# EAGLE schematic cansat (EAGLE 9.6.2)
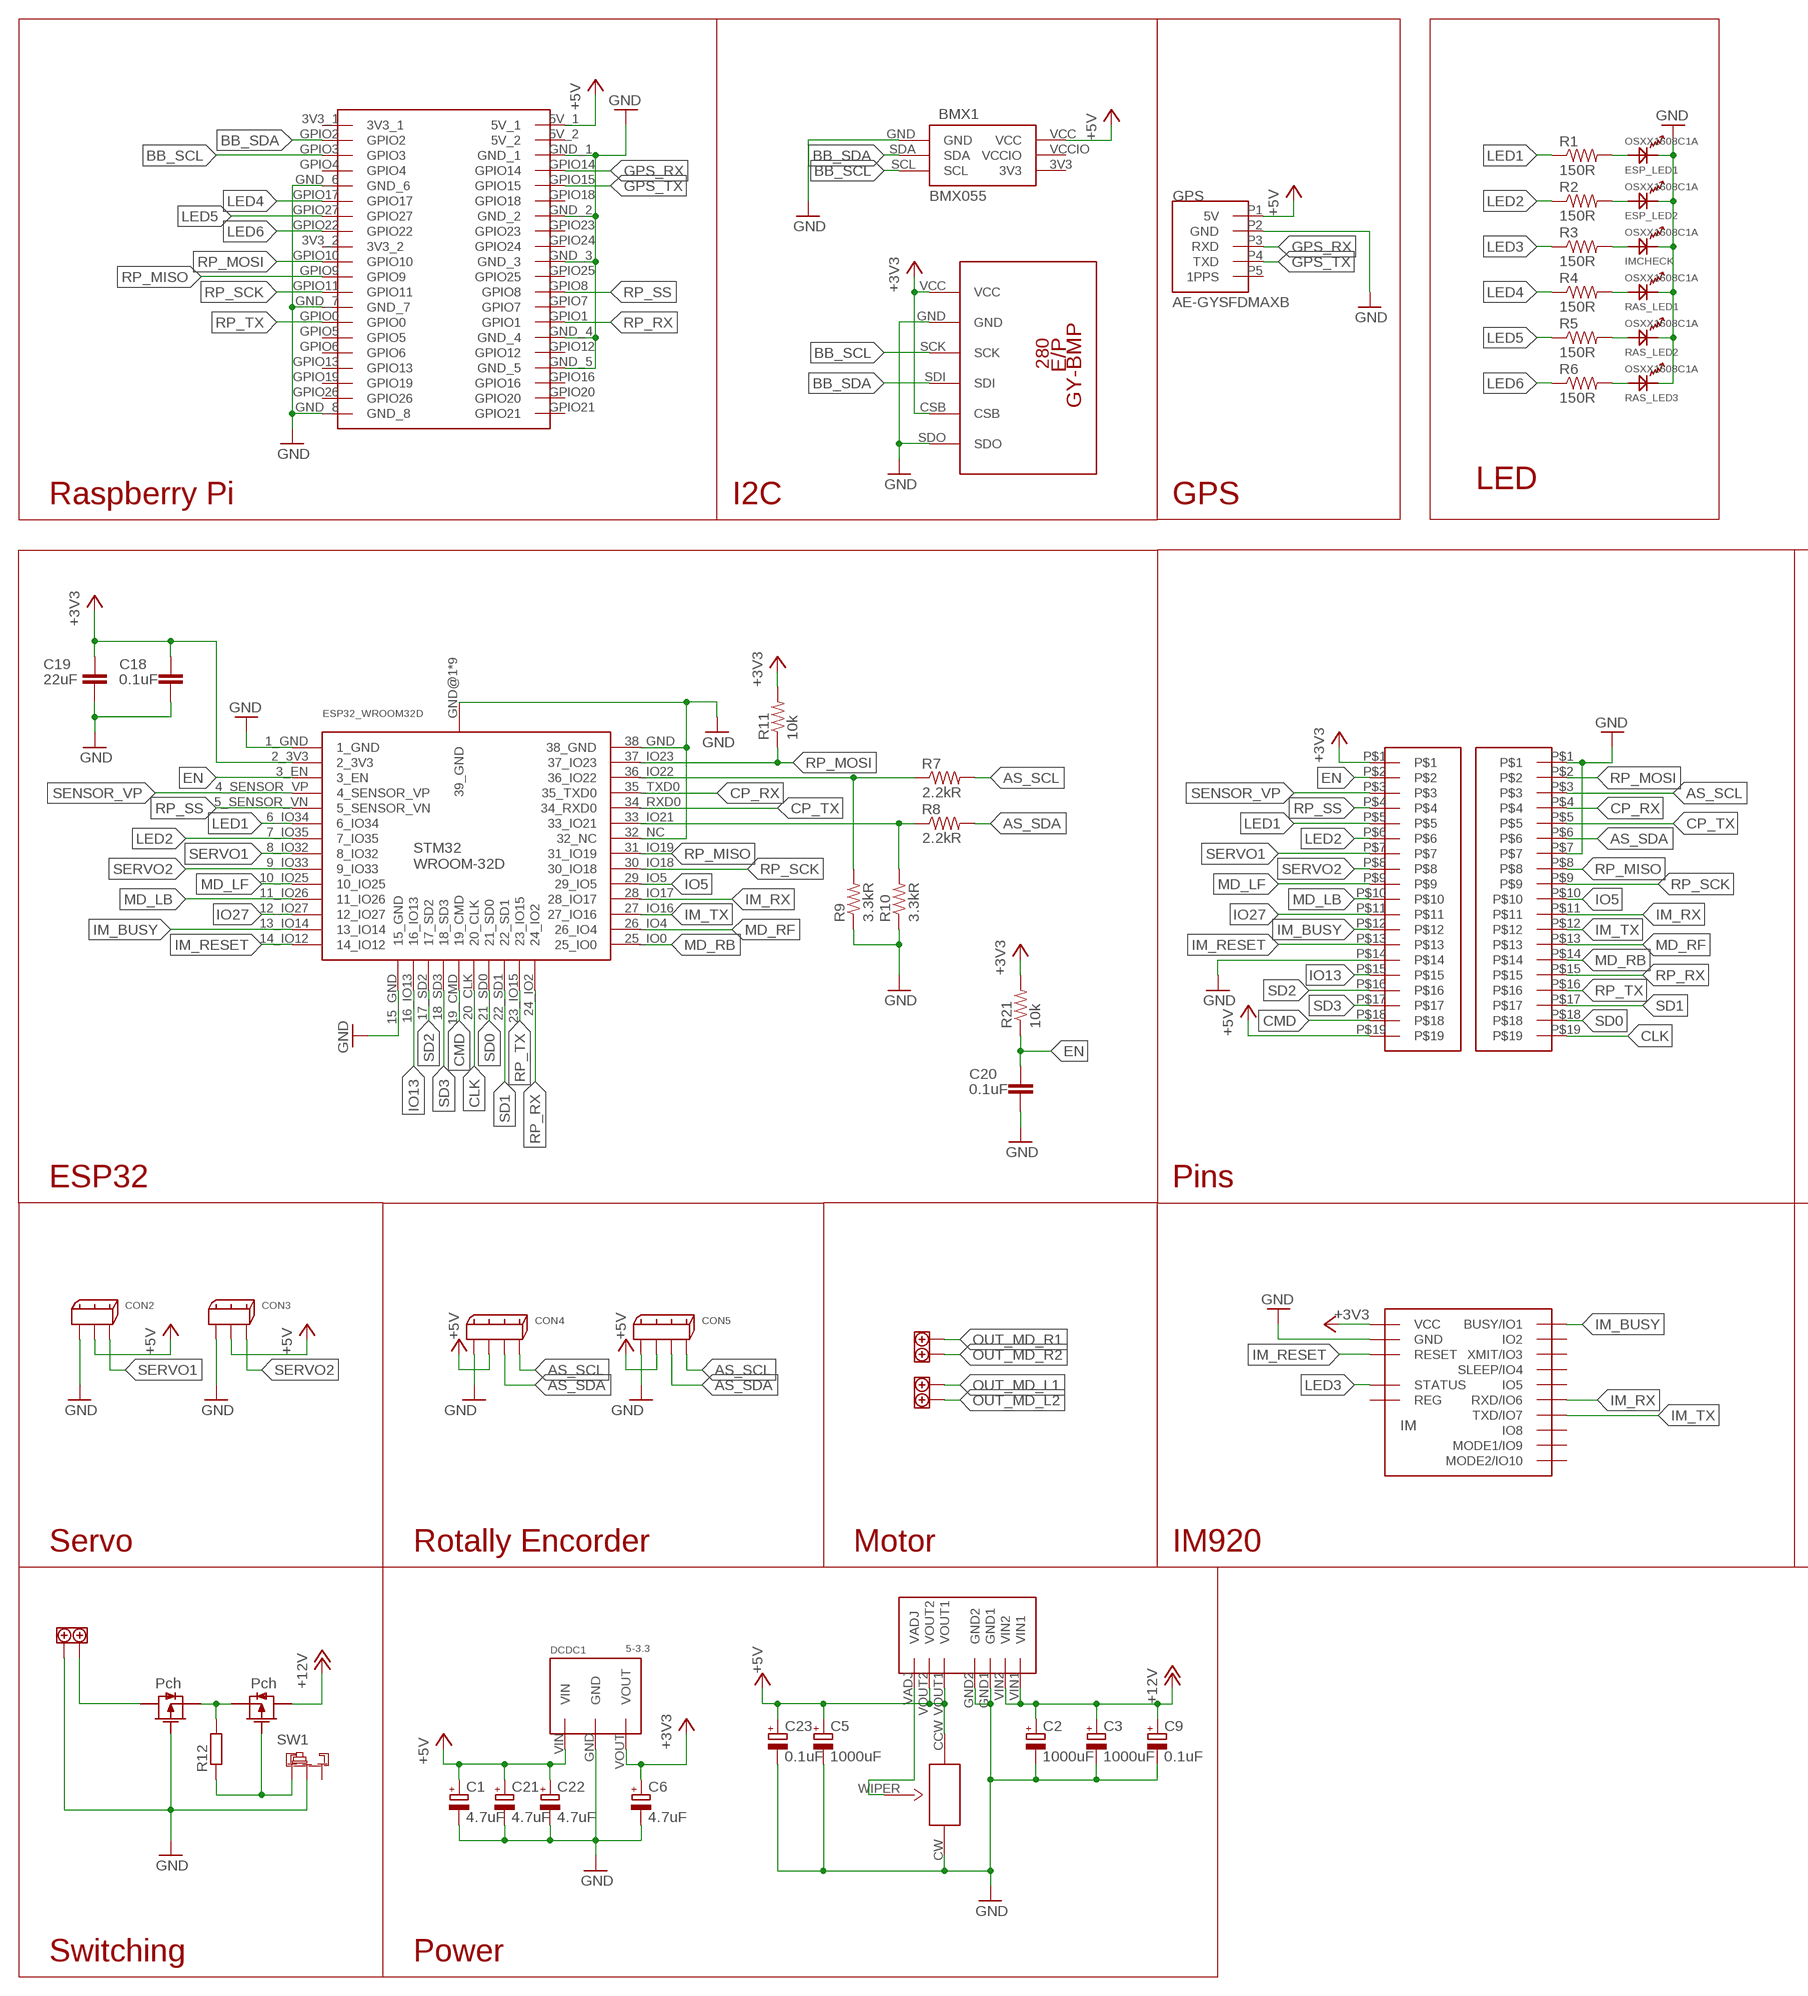
[diagram p0: schematic, sheet 1, part 1 of 2]
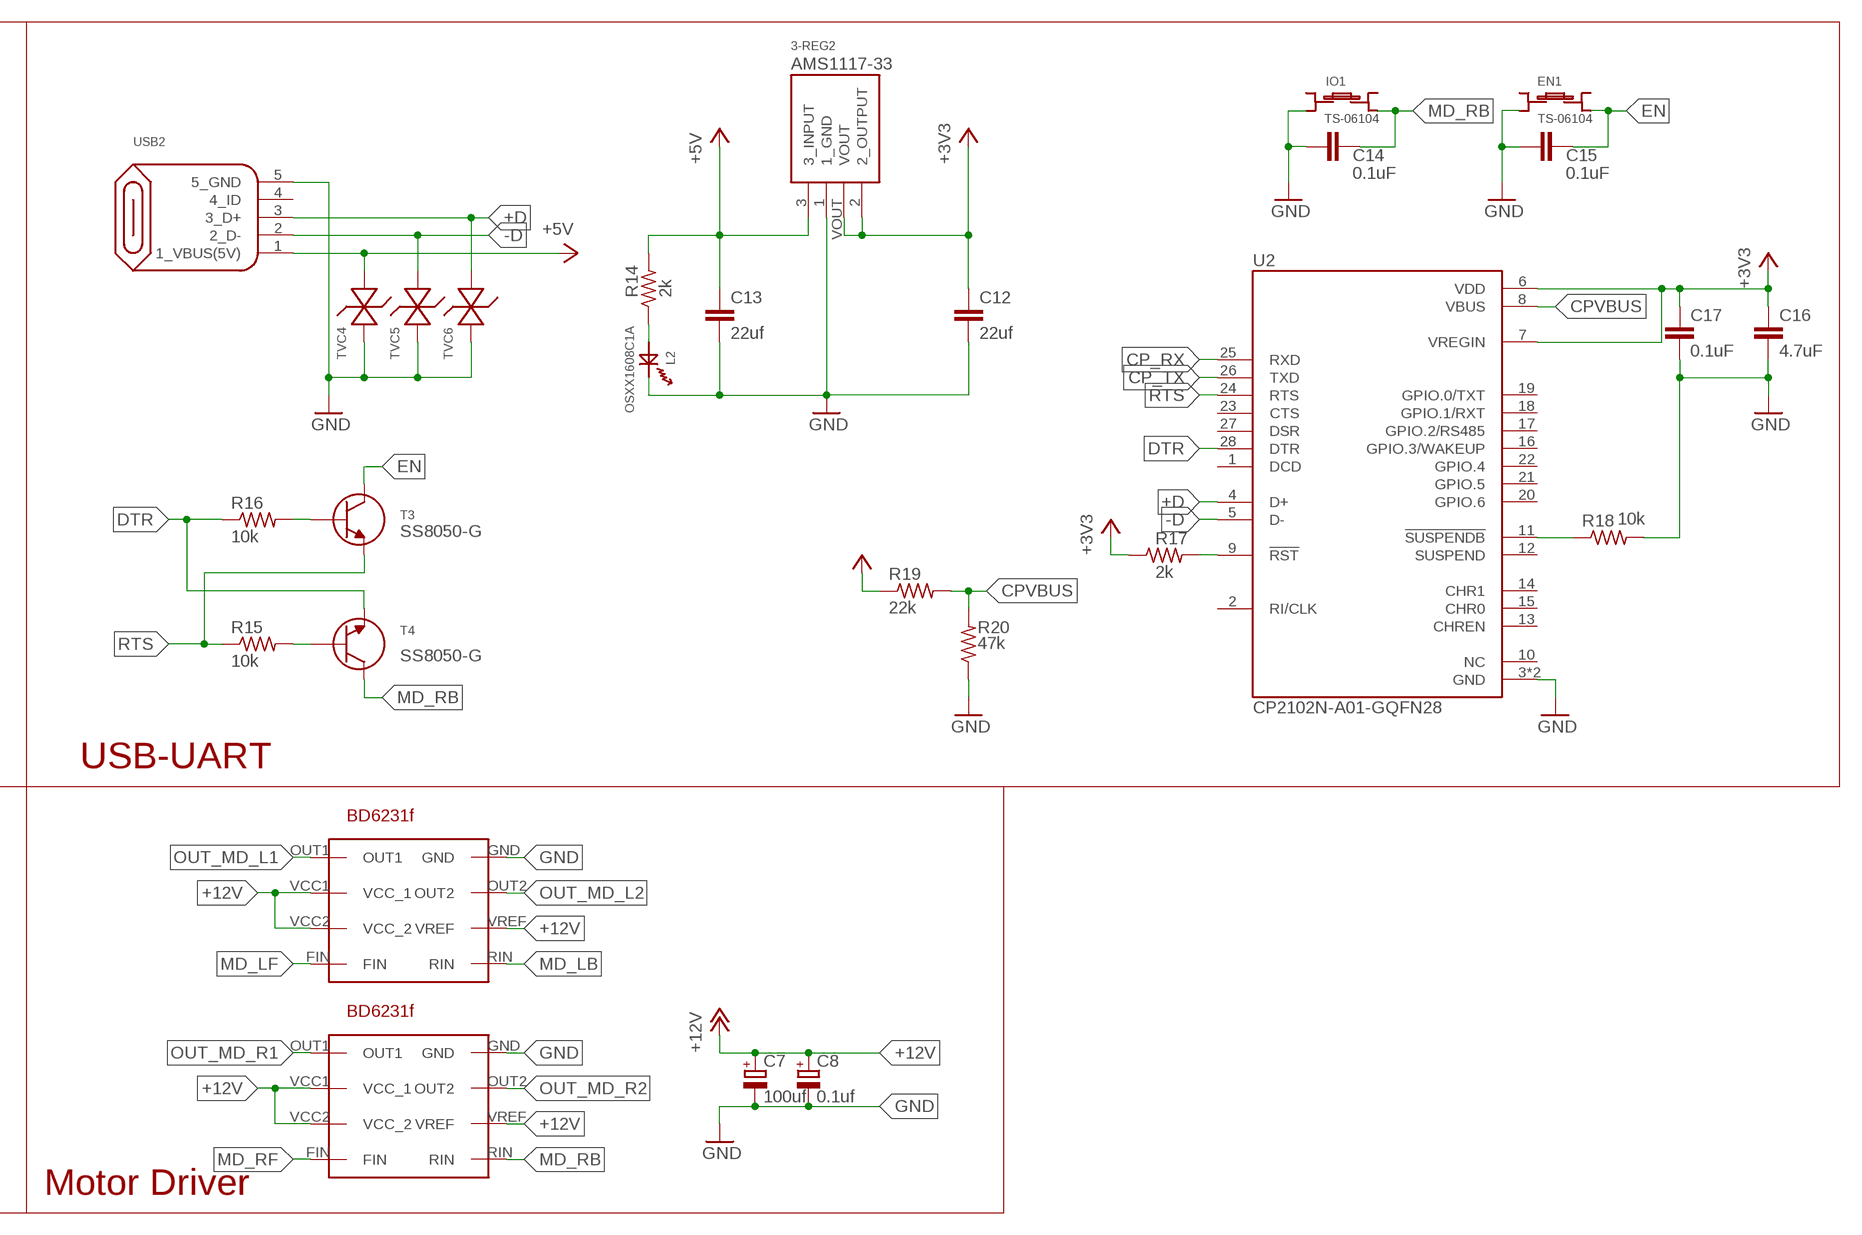
[diagram p1: schematic, sheet 1, part 2 of 2]

## Parts
3-REG2  AZ1117CH-3.3TRG1  [AZ1117CH-3.3TRG1]
100KR1  100kR  3362P  [3362P]
BMX1  BMX055  [BMX055]
C1  4.7uF  CPOL-EUE2.5-7  [E2,5-7]
C2  1000uF  CPOL-EUE5-10.5  [E5-10,5]
C3  1000uF  CPOL-EUE5-10.5  [E5-10,5]
C5  1000uF  CPOL-EUE5-10.5  [E5-10,5]
C6  4.7uF  CPOL-EUE2.5-7  [E2,5-7]
C7  100uf  CPOL-EUE2.5-7  [E2,5-7]
C8  0.1uf  CPOL-EUE2.5-7  [E2,5-7]
C9  0.1uF  CPOL-EUE2.5-7  [E2,5-7]
C12  22uf  C-EUC0603  [C0603]
C13  22uf  C-EUC0603  [C0603]
C14  0.1uF  C-EUC0603  [C0603]
C15  0.1uF  C-EUC0603  [C0603]
C16  4.7uF  C-EUC0402  [C0402]
C17  0.1uF  C-EUC0603  [C0603]
C18  0.1uF  C-EUC0603  [C0603]
C19  22uF  C-EUC0603  [C0603]
C20  0.1uF  C-EUC0603  [C0603]
C21  4.7uF  CPOL-EUE2.5-7  [E2,5-7]
C22  4.7uF  CPOL-EUE2.5-7  [E2,5-7]
C23  0.1uF  CPOL-EUE5-10.5  [E5-10,5]
CON2  2.5_MINI-SPOX_3PIN  [2.5_MINI-SPOX_3PIN]
CON3  2.5_MINI-SPOX_3PIN  [2.5_MINI-SPOX_3PIN]
CON4  2.5_MINI-SPOX_4PIN  [2.5_MINI-SPOX_4PIN]
CON5  2.5_MINI-SPOX_4PIN  [2.5_MINI-SPOX_4PIN]
DCDC1  5-3.3  3.3V0.5A_M78AR05-0.5  [3.3V0.5A_M78AR05-0.5]
EN1  TS-06104  [TS-06104]
ESP32_WROOM32D  ESP32-WROOM-32D  [ESP32-WROOM-32D]
ESP_LED1  OSXX1608C1A  [OSXX1608C1A]
ESP_LED2  OSXX1608C1A  [OSXX1608C1A]
GPS  AE-GYSFDMAXB  [AE-GYSFDMAXB]
IM  IM920C  [IM920C]
IMCHECK  OSXX1608C1A  [OSXX1608C1A]
IO1  TS-06104  [TS-06104]
L2  OSXX1608C1A  [OSXX1608C1A]
MD_L  BD6231F  [BD6231F]
MD_R  BD6231F  [BD6231F]
PIN_L  19_2.54  [19_2.54]
PIN_R  19_2.54  [19_2.54]
R1  150R  R-US_R0603  [R0603]
R2  150R  R-US_R0603  [R0603]
R3  150R  R-US_R0603  [R0603]
R4  150R  R-US_R0603  [R0603]
R5  150R  R-US_R0603  [R0603]
R6  150R  R-US_R0603  [R0603]
R7  2.2kR  R-US_R0603  [R0603]
R8  2.2kR  R-US_R0603  [R0603]
R9  3.3kR  R-US_R0603  [R0603]
R10  3.3kR  R-US_R0603  [R0603]
R11  10k  R-US_R0201  [R0201]
R12  R-EU_0207/10  [0207/10]
R14  2k  R-US_R0201  [R0201]
R15  10k  R-US_R0201  [R0201]
R16  10k  R-US_R0201  [R0201]
R17  2k  R-US_R0201  [R0201]
R18  10k  R-US_R0201  [R0201]
R19  22k  R-US_R0201  [R0201]
R20  47k  R-US_R0201  [R0201]
R21  10k  R-US_R0201  [R0201]
RAS_LED1  OSXX1608C1A  [OSXX1608C1A]
RAS_LED2  OSXX1608C1A  [OSXX1608C1A]
RAS_LED3  OSXX1608C1A  [OSXX1608C1A]
RASPBERRYPI_4B  RASPBERRYPI4B  [RASPBERRYPI4B]
SW1  SRIDE_SWITCH  [SRIDE_SWITCH]
T3  NPN_SS8050-G  [NPN_SS8050-G]
T4  NPN_SS8050-G  [NPN_SS8050-G]
TM1  TERMINAL_SLOPED_2PIN  [TERMINAL_SLOPED_2PIN]
TM2  TERMINAL_SLOPED_2PIN  [TERMINAL_SLOPED_2PIN]
TM3  TERMINAL_SLOPED_2PIN  [TERMINAL_SLOPED_2PIN]
TVC4  ESD5484FCT5G  [ESD5484FCT5G]
TVC5  ESD5484FCT5G  [ESD5484FCT5G]
TVC6  ESD5484FCT5G  [ESD5484FCT5G]
U2  CP2102N-A01-GQFN28  [QFN50P500X500X80-29N]
U$7  2SJ681-PCH  [2SJ681]
U$8  5V3A_KIC-053  [5V3A_KIC-053]
U$9  GY-BPM280  [GY-BMP280-FOOTPRINT]
U$10  2SJ681-PCH  [2SJ681]
USB2  MICRO-B_ZX62R-B-5P  [MICRO-B_ZX62R-B-5P]

## Nets
+3V3: 3-REG2.2(2_OUTPUT) 3-REG2.VOUT C6.+ C12.1 C16.1 C17.1 C18.1 C19.1 DCDC1.VOUT ESP32_WROOM32D.2_3V3 IM.$P17(VCC) PIN_L.P$1 R11.2 R17.1 R21.2 U2.6(VDD) U2.7(VREGIN) U$9.CSB U$9.VCC
+5V: 3-REG2.3(3_INPUT) 100KR1.CCW BMX1.VCC C1.+ C5.+ C13.1 C21.+ C22.+ C23.+ CON2.2 CON3.2 CON4.P$2 CON5.P$2 DCDC1.VIN GPS.P1(5V) PIN_L.P$19 R14.2 R19.1 RASPBERRYPI_4B.5V_1 TVC4.2_AN U$8.VOUT1 U$8.VOUT2 USB2.1(1_VBUS(5V))
+12V: C2.+ C3.+ C7.+ C8.+ C9.+ MD_L.VCC1(VCC_1) MD_L.VCC2(VCC_2) MD_L.VREF MD_R.VCC1(VCC_1) MD_R.VCC2(VCC_2) MD_R.VREF U$8.VIN1 U$8.VIN2 U$10.DRAIN
+D: TVC6.2_AN U2.4(D+) USB2.3(3_D+)
-D: TVC5.2_AN U2.5(D-) USB2.2(2_D-)
A7_1: R12.2 U$7.SOURCE U$10.SOURCE
AS_SCL: CON4.P$4 CON5.P$4 PIN_R.P$3 R7.2
AS_SDA: CON4.P$3 CON5.P$3 PIN_R.P$6 R8.2
BB_SCL: BMX1.SCL RASPBERRYPI_4B.GPIO3 U$9.SCK
BB_SDA: BMX1.SDA RASPBERRYPI_4B.GPIO2 U$9.SDI
CLK: ESP32_WROOM32D.20_CLK PIN_R.P$19
CMD: ESP32_WROOM32D.19_CMD PIN_L.P$18
CP_RX: ESP32_WROOM32D.35_TXD0 PIN_R.P$4 U2.25(RXD)
CP_TX: ESP32_WROOM32D.34_RXD0 PIN_R.P$5 U2.26(TXD)
CPVBUS: R19.2 R20.2 U2.8(VBUS)
DTR: R16.1 T4.2 U2.28(DTR)
EN: C15.1 C20.1 EN1.D ESP32_WROOM32D.3_EN PIN_L.P$2 R21.1 T3.3
GND [GND_+12V]: 3-REG2.1(1_GND) 100KR1.CW BMX1.GND C1.- C2.- C3.- C5.- C6.- C7.- C8.- C9.- C12.2 C13.2 C14.2 C15.2 C16.2 C17.2 C18.2 C19.2 C20.2 C21.- C22.- C23.- CON2.1 CON3.1 CON4.P$1 CON5.P$1 DCDC1.GND EN1.B ESP32_WROOM32D.1_GND ESP32_WROOM32D.15_GND ESP32_WROOM32D.32_NC ESP32_WROOM32D.38_GND ESP32_WROOM32D.GND@1(39_GND) ESP32_WROOM32D.GND@2(39_GND) ESP32_WROOM32D.GND@3(39_GND) ESP32_WROOM32D.GND@4(39_GND) ESP32_WROOM32D.GND@5(39_GND) ESP32_WROOM32D.GND@6(39_GND) ESP32_WROOM32D.GND@7(39_GND) ESP32_WROOM32D.GND@8(39_GND) ESP32_WROOM32D.GND@9(39_GND) ESP_LED1.CT ESP_LED2.CT GPS.P2(GND) IM.$P18(GND) IMCHECK.CT IO1.B L2.CT MD_L.GND MD_R.GND PIN_L.P$14 PIN_R.P$1 PIN_R.P$7 R9.1 R10.1 R18.2 R20.1 RAS_LED1.CT RAS_LED2.CT RAS_LED3.CT RASPBERRYPI_4B.GND_1 RASPBERRYPI_4B.GND_2 RASPBERRYPI_4B.GND_3 RASPBERRYPI_4B.GND_4 RASPBERRYPI_4B.GND_5 RASPBERRYPI_4B.GND_6 RASPBERRYPI_4B.GND_7 RASPBERRYPI_4B.GND_8 SW1.LR TM3.2 TVC4.1_CT TVC5.1_CT TVC6.1_CT U2.3(GND) U2.29(GND) U$7.GATE U$8.GND1 U$8.GND2 U$9.GND U$9.SDO USB2.5(5_GND)
GPS_RX: GPS.P3(RXD) RASPBERRYPI_4B.GPIO14
GPS_TX: GPS.P4(TXD) RASPBERRYPI_4B.GPIO15
IM_BUSY: ESP32_WROOM32D.13_IO14 IM.$P1(BUSY/IO1) PIN_L.P$12
IM_RESET: ESP32_WROOM32D.14_IO12 IM.$P19(RESET) PIN_L.P$13
IM_RX: ESP32_WROOM32D.28_IO17 IM.$P6(RXD/IO6) PIN_R.P$11
IM_TX: ESP32_WROOM32D.27_IO16 IM.$P7(TXD/IO7) PIN_R.P$12
IO5: ESP32_WROOM32D.29_IO5 PIN_R.P$10
IO13: ESP32_WROOM32D.16_IO13 PIN_L.P$15
IO27: ESP32_WROOM32D.12_IO27 PIN_L.P$11
LED1: ESP32_WROOM32D.6_IO34 PIN_L.P$5 R1.1
LED2: ESP32_WROOM32D.7_IO35 PIN_L.P$6 R2.1
LED3: IM.$P15(STATUS) R3.1
LED4: R4.1 RASPBERRYPI_4B.GPIO17
LED5: R5.1 RASPBERRYPI_4B.GPIO27
LED6: R6.1 RASPBERRYPI_4B.GPIO22
MD_LB: ESP32_WROOM32D.11_IO26 MD_L.RIN PIN_L.P$10
MD_LF: ESP32_WROOM32D.10_IO25 MD_L.FIN PIN_L.P$9
MD_RB: C14.1 ESP32_WROOM32D.25_IO0 IO1.D MD_R.RIN PIN_R.P$14 T4.3
MD_RF: ESP32_WROOM32D.26_IO4 MD_R.FIN PIN_R.P$13
N$1: ESP_LED1.AN R1.2
N$2: ESP_LED2.AN R2.2
N$3: IMCHECK.AN R3.2
N$4: R4.2 RAS_LED1.AN
N$5: R5.2 RAS_LED2.AN
N$6: R6.2 RAS_LED3.AN
N$7: ESP32_WROOM32D.36_IO22 R7.1 R9.2
N$8: ESP32_WROOM32D.33_IO21 R8.1 R10.2
N$9: TM3.1 U$7.DRAIN
N$13: L2.AN R14.1
N$14: R16.2 T3.1
N$15: R15.2 T4.1
N$16: R17.2 U2.9(!RST)
N$17: R18.1 U2.11(!SUSPENDB)
N$18: 100KR1.WIPER U$8.VADJ
N$20: R12.1 SW1.L U$10.GATE
OUT_MD_L1 [GND_+12V]: MD_L.OUT1 TM2.1
OUT_MD_L2 [GND_+12V]: MD_L.OUT2 TM2.2
OUT_MD_R1 [GND_+12V]: MD_R.OUT1 TM1.1
OUT_MD_R2 [GND_+12V]: MD_R.OUT2 TM1.2
RP_MISO: ESP32_WROOM32D.31_IO19 PIN_R.P$8 RASPBERRYPI_4B.GPIO9
RP_MOSI: ESP32_WROOM32D.37_IO23 PIN_R.P$2 R11.1 RASPBERRYPI_4B.GPIO10
RP_RX: ESP32_WROOM32D.24_IO2 PIN_R.P$15 RASPBERRYPI_4B.GPIO1
RP_SCK: ESP32_WROOM32D.30_IO18 PIN_R.P$9 RASPBERRYPI_4B.GPIO11
RP_SS: ESP32_WROOM32D.5_SENSOR_VN PIN_L.P$4 RASPBERRYPI_4B.GPIO8
RP_TX: ESP32_WROOM32D.23_IO15 PIN_R.P$16 RASPBERRYPI_4B.GPIO0
RTS: R15.1 T3.2 U2.24(RTS)
SD0: ESP32_WROOM32D.21_SD0 PIN_R.P$18
SD1: ESP32_WROOM32D.22_SD1 PIN_R.P$17
SD2: ESP32_WROOM32D.17_SD2 PIN_L.P$16
SD3: ESP32_WROOM32D.18_SD3 PIN_L.P$17
SENSOR_VP: ESP32_WROOM32D.4_SENSOR_VP PIN_L.P$3
SERVO1: CON2.3 ESP32_WROOM32D.8_IO32 PIN_L.P$7
SERVO2: CON3.3 ESP32_WROOM32D.9_IO33 PIN_L.P$8
Unconnected: EN1.A EN1.C GPS.P5(1PPS) IM.$P2(IO2) IM.$P3(XMIT/IO3) IM.$P4(SLEEP/IO4) IM.$P5(IO5) IM.$P8(IO8) IM.$P9(MODE1/IO9) IM.$P10(MODE2/IO10) IM.$P16(REG) IO1.A IO1.C RASPBERRYPI_4B.3V3_1 RASPBERRYPI_4B.3V3_2 RASPBERRYPI_4B.5V_2 RASPBERRYPI_4B.GPIO4 RASPBERRYPI_4B.GPIO5 RASPBERRYPI_4B.GPIO6 RASPBERRYPI_4B.GPIO7 RASPBERRYPI_4B.GPIO12 RASPBERRYPI_4B.GPIO13 RASPBERRYPI_4B.GPIO16 RASPBERRYPI_4B.GPIO18 RASPBERRYPI_4B.GPIO19 RASPBERRYPI_4B.GPIO20 RASPBERRYPI_4B.GPIO21 RASPBERRYPI_4B.GPIO23 RASPBERRYPI_4B.GPIO24 RASPBERRYPI_4B.GPIO25 RASPBERRYPI_4B.GPIO26 SW1.R U2.1(DCD) U2.2(RI/CLK) U2.10(NC) U2.12(SUSPEND) U2.13(CHREN) U2.14(CHR1) U2.15(CHR0) U2.16(GPIO.3/WAKEUP) U2.17(GPIO.2/RS485) U2.18(GPIO.1/RXT) U2.19(GPIO.0/TXT) U2.20(GPIO.6) U2.21(GPIO.5) U2.22(GPIO.4) U2.23(CTS) U2.27(DSR) USB2.4(4_ID)

## Notes on the sheet
- LED
- Raspberry Pi | I2C | GPS
- SS8050-G
- SS8050-G
- ESP32 | Pins | USB-UART
- Servo | Rotally Encorder | Motor | IM920 | Motor Driver
- Switching | Power

## Power pins joined to a net without a drawn wire
3V3: BMX1.3V3
VCCIO: BMX1.VCCIO

## Library data of the parts
3-REG2 = Chip 3-Terminal Regulator:AZ1117CH-3.3TRG1
100KR1 = TRIM_register:3362P
BMX1 = BMX055:BMX055
C1-C3 C5-C9 C21-C23 = rcl:CPOL-EU: POLARIZED CAPACITOR, European symbol; SPICEPREFIX: C
C12-C20 = rcl:C-EU: CAPACITOR, European symbol; SPICEPREFIX: C
CON2 CON3 = Connector:2.5_MINI-SPOX_3PIN
CON4 CON5 = Connector:2.5_MINI-SPOX_4PIN
DCDC1 = DC-DC:3.3V0.5A_M78AR05-0.5
EN1 IO1 = Switches:TS-06104
ESP32_WROOM32D = ESP32:ESP32-WROOM-32D
ESP_LED1 ESP_LED2 IMCHECK L2 RAS_LED1-RAS_LED3 = ChipLED:OSXX1608C1A
GPS = AE-GYSFDMAXB:AE-GYSFDMAXB
IM = IM920:IM920C
MD_L MD_R = Motor Driver:BD6231F
PIN_L PIN_R = JumperPins:19_2.54
R1-R11 R14-R21 = rcl:R-US_: RESISTOR, American symbol; SPICEPREFIX: R
R12 = rcl:R-EU_: RESISTOR, European symbol; SPICEPREFIX: R
RASPBERRYPI_4B = RASPBERRYPI4B:RASPBERRYPI4B
SW1 = Switches:SRIDE_SWITCH
T3 T4 = ChipTransister:NPN_SS8050-G
TM1-TM3 = TerminalBrock:TERMINAL_SLOPED_2PIN
TVC4-TVC6 = TVC Diode:ESD5484FCT5G
U2 = CP2102N-A01-GQFN28:CP2102N-A01-GQFN28: USB Bridge, USB to UART USB 2.0 UART Interface 28-QFN (5x5) Check availability <https://pricing.snapeda.com/parts/CP2102N-A01-GQFN28/Silicon%20Labs/view-part?ref=eda>; AVAILABILITY: In Stock; DESCRIPTION: USB Bridge, USB to UART USB 2.0 UART Interface 28-QFN (5x5); MF: Silicon Labs; MP: CP2102N-A01-GQFN28; PACKAGE: QFN-28 Silicon Labs; PRICE: None; PURCHASE-URL: https://pricing.snapeda.com/search/part/CP2102N-A01-GQFN28/?ref=eda
U$7 U$10 = mosfet:2SJ681-PCH
U$8 = DC-DC:5V3A_KIC-053
U$9 = BMP280:GY-BPM280
USB2 = USB:MICRO-B_ZX62R-B-5P

## Net classes
1 esp: width 0.254 mm, drill 0.127 mm, clearance 0.025 mm
2 GND_+12V: width 0.305 mm